# Altium project Archimajor.PrjPcb (part 3 of 3)

## Sheet Encoders.SchDoc
size Letter
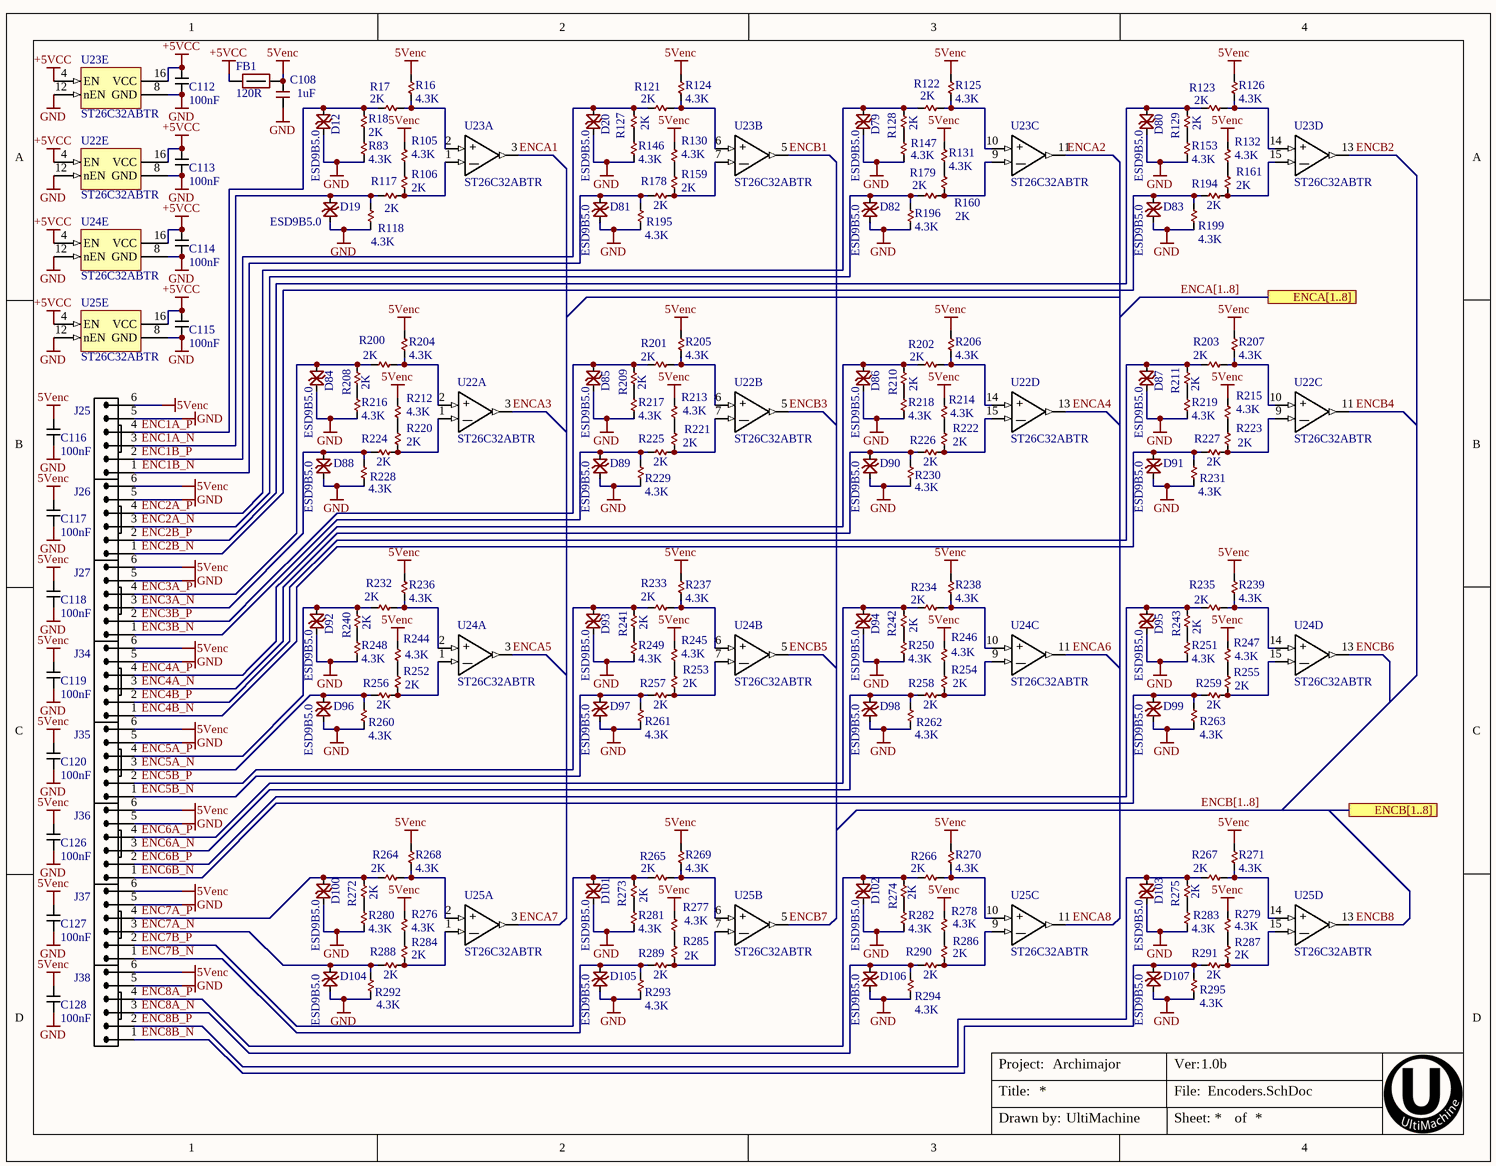
[diagram p7: Encoders.SchDoc]

### Parts
C108  1uF  [C0402]
C112  100nF  [C0201 Large Pads]
C113  100nF  [C0201 Large Pads]
C114  100nF  [C0201 Large Pads]
C115  100nF  [C0201 Large Pads]
C116  100nF  [C0201 Large Pads]
C117  100nF  [C0201 Large Pads]
C118  100nF  [C0201 Large Pads]
C119  100nF  [C0201 Large Pads]
C120  100nF  [C0201 Large Pads]
C126  100nF  [C0201 Large Pads]
C127  100nF  [C0201 Large Pads]
C128  100nF  [C0201 Large Pads]
D12  ESD9B5.0  [SOD923-D]
D19  ESD9B5.0  [SOD923-D]
D20  ESD9B5.0  [SOD923-D]
D79  ESD9B5.0  [SOD923-D]
D80  ESD9B5.0  [SOD923-D]
D81  ESD9B5.0  [SOD923-D]
D82  ESD9B5.0  [SOD923-D]
D83  ESD9B5.0  [SOD923-D]
D84  ESD9B5.0  [SOD923-D]
D85  ESD9B5.0  [SOD923-D]
D86  ESD9B5.0  [SOD923-D]
D87  ESD9B5.0  [SOD923-D]
D88  ESD9B5.0  [SOD923-D]
D89  ESD9B5.0  [SOD923-D]
D90  ESD9B5.0  [SOD923-D]
D91  ESD9B5.0  [SOD923-D]
D92  ESD9B5.0  [SOD923-D]
D93  ESD9B5.0  [SOD923-D]
D94  ESD9B5.0  [SOD923-D]
D95  ESD9B5.0  [SOD923-D]
D96  ESD9B5.0  [SOD923-D]
D97  ESD9B5.0  [SOD923-D]
D98  ESD9B5.0  [SOD923-D]
D99  ESD9B5.0  [SOD923-D]
D100  ESD9B5.0  [SOD923-D]
D101  ESD9B5.0  [SOD923-D]
D102  ESD9B5.0  [SOD923-D]
D103  ESD9B5.0  [SOD923-D]
D104  ESD9B5.0  [SOD923-D]
D105  ESD9B5.0  [SOD923-D]
D106  ESD9B5.0  [SOD923-D]
D107  ESD9B5.0  [SOD923-D]
FB1  120R  [FB0603]
J25  Molex 70543-05  [70543-05_PIN-IN-PASTE]  (value not drawn)
J26  Molex 70543-05  [70543-05_PIN-IN-PASTE]  (value not drawn)
J27  Molex 70543-05  [70543-05_PIN-IN-PASTE]  (value not drawn)
J34  Molex 70543-05  [70543-05_PIN-IN-PASTE]  (value not drawn)
J35  Molex 70543-05  [70543-05_PIN-IN-PASTE]  (value not drawn)
J36  Molex 70543-05  [70543-05_PIN-IN-PASTE]  (value not drawn)
J37  Molex 70543-05  [70543-05_PIN-IN-PASTE]  (value not drawn)
J38  Molex 70543-05  [70543-05_PIN-IN-PASTE]  (value not drawn)
R16  4.3K  [R0402]
R17  2K  [R0402]
R18  2K  [R0402]
R83  4.3K  [R0402]
R105  4.3K  [R0402]
R106  2K  [R0402]
R117  2K  [R0402]
R118  4.3K  [R0402]
R121  2K  [R0402]
R122  2K  [R0402]
R123  2K  [R0402]
R124  4.3K  [R0402]
R125  4.3K  [R0402]
R126  4.3K  [R0402]
R127  2K  [R0402]
R128  2K  [R0402]
R129  2K  [R0402]
R130  4.3K  [R0402]
R131  4.3K  [R0402]
R132  4.3K  [R0402]
R146  4.3K  [R0402]
R147  4.3K  [R0402]
R153  4.3K  [R0402]
R159  2K  [R0402]
R160  2K  [R0402]
R161  2K  [R0402]
R178  2K  [R0402]
R179  2K  [R0402]
R194  2K  [R0402]
R195  4.3K  [R0402]
R196  4.3K  [R0402]
R199  4.3K  [R0402]
R200  2K  [R0402]
R201  2K  [R0402]
R202  2K  [R0402]
R203  2K  [R0402]
R204  4.3K  [R0402]
R205  4.3K  [R0402]
R206  4.3K  [R0402]
R207  4.3K  [R0402]
R208  2K  [R0402]
R209  2K  [R0402]
R210  2K  [R0402]
R211  2K  [R0402]
R212  4.3K  [R0402]
R213  4.3K  [R0402]
R214  4.3K  [R0402]
R215  4.3K  [R0402]
R216  4.3K  [R0402]
R217  4.3K  [R0402]
R218  4.3K  [R0402]
R219  4.3K  [R0402]
R220  2K  [R0402]
R221  2K  [R0402]
R222  2K  [R0402]
R223  2K  [R0402]
R224  2K  [R0402]
R225  2K  [R0402]
R226  2K  [R0402]
R227  2K  [R0402]
R228  4.3K  [R0402]
R229  4.3K  [R0402]
R230  4.3K  [R0402]
R231  4.3K  [R0402]
R232  2K  [R0402]
R233  2K  [R0402]
R234  2K  [R0402]
R235  2K  [R0402]
R236  4.3K  [R0402]
R237  4.3K  [R0402]
R238  4.3K  [R0402]
R239  4.3K  [R0402]
R240  2K  [R0402]
R241  2K  [R0402]
R242  2K  [R0402]
R243  2K  [R0402]
R244  4.3K  [R0402]
R245  4.3K  [R0402]
R246  4.3K  [R0402]
R247  4.3K  [R0402]
R248  4.3K  [R0402]
R249  4.3K  [R0402]
R250  4.3K  [R0402]
R251  4.3K  [R0402]
R252  2K  [R0402]
R253  2K  [R0402]
R254  2K  [R0402]
R255  2K  [R0402]
R256  2K  [R0402]
R257  2K  [R0402]
R258  2K  [R0402]
R259  2K  [R0402]
R260  4.3K  [R0402]
R261  4.3K  [R0402]
R262  4.3K  [R0402]
R263  4.3K  [R0402]
R264  2K  [R0402]
R265  2K  [R0402]
R266  2K  [R0402]
R267  2K  [R0402]
R268  4.3K  [R0402]
R269  4.3K  [R0402]
R270  4.3K  [R0402]
R271  4.3K  [R0402]
R272  2K  [R0402]
R273  2K  [R0402]
R274  2K  [R0402]
R275  2K  [R0402]
R276  4.3K  [R0402]
R277  4.3K  [R0402]
R278  4.3K  [R0402]
R279  4.3K  [R0402]
R280  4.3K  [R0402]
R281  4.3K  [R0402]
R282  4.3K  [R0402]
R283  4.3K  [R0402]
R284  2K  [R0402]
R285  2K  [R0402]
R286  2K  [R0402]
R287  2K  [R0402]
R288  2K  [R0402]
R289  2K  [R0402]
R290  2K  [R0402]
R291  2K  [R0402]
R292  4.3K  [R0402]
R293  4.3K  [R0402]
R294  4.3K  [R0402]
R295  4.3K  [R0402]
U22  ST26C32ABTR  [TSSOP16-65P640X120-16N]  (parts A,B,C,D,E of 5)
U23  ST26C32ABTR  [TSSOP16-65P640X120-16N]  (parts A,B,C,D,E of 5)
U24  ST26C32ABTR  [TSSOP16-65P640X120-16N]  (parts A,B,C,D,E of 5)
U25  ST26C32ABTR  [TSSOP16-65P640X120-16N]  (parts A,B,C,D,E of 5)

### Ports
ENCA[1..8], ENCB[1..8]

### Nets
5Venc: C108.2 C116.2 C117.2 C118.2 C119.2 C120.2 C126.2 C127.2 C128.2 FB1.2 J25.6 J26.6 J27.6 J34.6 J35.6 J36.6 J37.6 J38.6 R16.2 R105.2 R124.2 R125.2 R126.2 R130.2 R131.2 R132.2 R204.2 R205.2 R206.2 R207.2 R212.2 R213.2 R214.2 R215.2 R236.2 R237.2 R238.2 R239.2 R244.2 R245.2 R246.2 R247.2 R268.2 R269.2 R270.2 R271.2 R276.2 R277.2 R278.2 R279.2
+5VCC: C112.2 C113.2 C114.2 C115.2 FB1.1 U22.4(EN) U22.16(VCC) U23.4(EN) U23.16(VCC) U24.4(EN) U24.16(VCC) U25.4(EN) U25.16(VCC)
GND: C108.1 C112.1 C113.1 C114.1 C115.1 C116.1 C117.1 C118.1 C119.1 C120.1 C126.1 C127.1 C128.1 D12.K D19.K D20.K D79.K D80.K D81.K D82.K D83.K D84.K D85.K D86.K D87.K D88.K D89.K D90.K D91.K D92.K D93.K D94.K D95.K D96.K D97.K D98.K D99.K D100.K D101.K D102.K D103.K D104.K D105.K D106.K D107.K J25.5 J26.5 J27.5 J34.5 J35.5 J36.5 J37.5 J38.5 R83.1 R118.1 R146.1 R147.1 R153.1 R195.1 R196.1 R199.1 R216.1 R217.1 R218.1 R219.1 R228.1 R229.1 R230.1 R231.1 R248.1 R249.1 R250.1 R251.1 R260.1 R261.1 R262.1 R263.1 R280.1 R281.1 R282.1 R283.1 R292.1 R293.1 R294.1 R295.1 U22.8(GND) U22.12(nEN) U23.8(GND) U23.12(nEN) U24.8(GND) U24.12(nEN) U25.8(GND) U25.12(nEN)
ENC1A_N: D19.A J25.3 R117.2 R118.2
ENC1A_P: D12.A J25.4 R17.1 R18.2
ENC1B_N: D81.A J25.1 R178.2 R195.2
ENC1B_P: D20.A J25.2 R121.1 R127.2
ENC2A_N: D82.A J26.3 R179.2 R196.2
ENC2A_P: D79.A J26.4 R122.1 R128.2
ENC2B_N: D83.A J26.1 R194.2 R199.2
ENC2B_P: D80.A J26.2 R123.1 R129.2
ENC3A_N: D88.A J27.3 R224.2 R228.2
ENC3A_P: D84.A J27.4 R200.1 R208.2
ENC3B_N: D89.A J27.1 R225.2 R229.2
ENC3B_P: D85.A J27.2 R201.1 R209.2
ENC4A_N: D90.A J34.3 R226.2 R230.2
ENC4A_P: D86.A J34.4 R202.1 R210.2
ENC4B_N: D91.A J34.1 R227.2 R231.2
ENC4B_P: D87.A J34.2 R203.1 R211.2
ENC5A_N: D96.A J35.3 R256.2 R260.2
ENC5A_P: D92.A J35.4 R232.1 R240.2
ENC5B_N: D97.A J35.1 R257.2 R261.2
ENC5B_P: D93.A J35.2 R233.1 R241.2
ENC6A_N: D98.A J36.3 R258.2 R262.2
ENC6A_P: D94.A J36.4 R234.1 R242.2
ENC6B_N: D99.A J36.1 R259.2 R263.2
ENC6B_P: D95.A J36.2 R235.1 R243.2
ENC7A_N: D104.A J37.3 R288.2 R292.2
ENC7A_P: D100.A J37.4 R264.1 R272.2
ENC7B_N: D105.A J37.1 R289.2 R293.2
ENC7B_P: D101.A J37.2 R265.1 R273.2
ENC8A_N: D106.A J38.3 R290.2 R294.2
ENC8A_P: D102.A J38.4 R266.1 R274.2
ENC8B_N: D107.A J38.1 R291.2 R295.2
ENC8B_P: D103.A J38.2 R267.1 R275.2
ENCA1: U23.3(OUT)
ENCA2: U23.11(OUT)
ENCA3: U22.3(OUT)
ENCA4: U22.13(OUT)
ENCA5: U24.3(OUT)
ENCA6: U24.11(OUT)
ENCA7: U25.3(OUT)
ENCA8: U25.11(OUT)
ENCB1: U23.5(OUT)
ENCB2: U23.13(OUT)
ENCB3: U22.5(OUT)
ENCB4: U22.11(OUT)
ENCB5: U24.5(OUT)
ENCB6: U24.13(OUT)
ENCB7: U25.5(OUT)
ENCB8: U25.13(OUT)
NetR16_1: R16.1 R17.2 U23.2(IN+)
NetR18_1: R18.1 R83.2
NetR105_1: R105.1 R106.2
NetR106_1: R106.1 R117.1 U23.1(IN-)
NetR121_2: R121.2 R124.1 U23.6(IN+)
NetR122_2: R122.2 R125.1 U23.10(IN+)
NetR123_2: R123.2 R126.1 U23.14(IN+)
NetR127_1: R127.1 R146.2
NetR128_1: R128.1 R147.2
NetR129_1: R129.1 R153.2
NetR130_1: R130.1 R159.2
NetR131_1: R131.1 R160.2
NetR132_1: R132.1 R161.2
NetR159_1: R159.1 R178.1 U23.7(IN-)
NetR160_1: R160.1 R179.1 U23.9(IN-)
NetR161_1: R161.1 R194.1 U23.15(IN-)
NetR200_2: R200.2 R204.1 U22.2(IN+)
NetR201_2: R201.2 R205.1 U22.6(IN+)
NetR202_2: R202.2 R206.1 U22.14(IN+)
NetR203_2: R203.2 R207.1 U22.10(IN+)
NetR208_1: R208.1 R216.2
NetR209_1: R209.1 R217.2
NetR210_1: R210.1 R218.2
NetR211_1: R211.1 R219.2
NetR212_1: R212.1 R220.2
NetR213_1: R213.1 R221.2
NetR214_1: R214.1 R222.2
NetR215_1: R215.1 R223.2
NetR220_1: R220.1 R224.1 U22.1(IN-)
NetR221_1: R221.1 R225.1 U22.7(IN-)
NetR222_1: R222.1 R226.1 U22.15(IN-)
NetR223_1: R223.1 R227.1 U22.9(IN-)
NetR232_2: R232.2 R236.1 U24.2(IN+)
NetR233_2: R233.2 R237.1 U24.6(IN+)
NetR234_2: R234.2 R238.1 U24.10(IN+)
NetR235_2: R235.2 R239.1 U24.14(IN+)
NetR240_1: R240.1 R248.2
NetR241_1: R241.1 R249.2
NetR242_1: R242.1 R250.2
NetR243_1: R243.1 R251.2
NetR244_1: R244.1 R252.2
NetR245_1: R245.1 R253.2
NetR246_1: R246.1 R254.2
NetR247_1: R247.1 R255.2
NetR252_1: R252.1 R256.1 U24.1(IN-)
NetR253_1: R253.1 R257.1 U24.7(IN-)
NetR254_1: R254.1 R258.1 U24.9(IN-)
NetR255_1: R255.1 R259.1 U24.15(IN-)
NetR264_2: R264.2 R268.1 U25.2(IN+)
NetR265_2: R265.2 R269.1 U25.6(IN+)
NetR266_2: R266.2 R270.1 U25.10(IN+)
NetR267_2: R267.2 R271.1 U25.14(IN+)
NetR272_1: R272.1 R280.2
NetR273_1: R273.1 R281.2
NetR274_1: R274.1 R282.2
NetR275_1: R275.1 R283.2
NetR276_1: R276.1 R284.2
NetR277_1: R277.1 R285.2
NetR278_1: R278.1 R286.2
NetR279_1: R279.1 R287.2
NetR284_1: R284.1 R288.1 U25.1(IN-)
NetR285_1: R285.1 R289.1 U25.7(IN-)
NetR286_1: R286.1 R290.1 U25.9(IN-)
NetR287_1: R287.1 R291.1 U25.15(IN-)

### Buses and harness runs
bus ENCA[1..8] = port ENCA[1..8]
bus ENCB[1..8] = port ENCB[1..8]

### Notes on the sheet
- Title:
- Project:
- File:
- Ver:
- Drawn by:
- Sheet:
- of
- (in symbol ST26C32ABTR, part A) +; _
- (in symbol ST26C32ABTR, part B) +; _
- (in symbol ST26C32ABTR, part C) +; _
- (in symbol ST26C32ABTR, part D) +; _

### Library data of the parts
C108 = 1uF 0402 6.3V X5R: CAP CER 0402 1uF 6.3V 10% X5R; MANUFACTURER: Murata; MANUFACTURER #: GRM155R60J105KE19D; PART: 1uF 6.3V X5R 0402; PART DESCRIPTION: 1µF ±10% 6.3V Ceramic Capacitor X5R 0402 (1005 Metric); DISTRIBUTOR #: 490-1320-2-ND; DISTRIBUTOR: Digikey; TOLERANCE: 10%; EE_SPEC: 6.3V; VALUE: 1uF
C112-C120 C126-C128 = 100nF 6.3V X5R 0201: CAP CER 0.1UF 6.3V 10% X5R 0201; MANUFACTURER: Samsung; MANUFACTURER #: CL03A104KQ3NNNC; VALUE: 100nF; DISTRIBUTOR: DIGI-KEY; DISTRIBUTOR #: 1276-1013-1-ND; TOLERANCE: 10%; VOLTAGE: 6.3V; PART: CL03A104KQ3NNNC
D12 D19 D20 D79-D107 = ESD9B5.0ST5G: TVS DIODE BIDIR 5VWM SOD923; MANUFACTURER: On Semi; TOLERANCE: -NA-; VALUE: 5V; EE_SPEC: 5Vso 15pF; MANUFACTURER #: ESD9B5.0ST5G; PART DESCRIPTION: TVS DIODE BIDIR 5VWM SOD923
FB1 = FERRITE 120R 3A 0603: FERRITE BEAD 120 OHM 0603 1LN; MANUFACTURER: Samsung; MANUFACTURER #: CIS10P121AC; MANUFACTURER2#: 490-5254-2-ND; VALUE: 120Rfb; TOLERANCE: -NA-; EE_SPEC: 3A; DISTRIBUTOR #: 1276-6351-2-ND; DISTRIBUTOR: Digi-Key Electronics; PART: CIS10P121AC; PART DESCRIPTION: FERRITE BEAD 120 OHM 0603 1LN
J25-J27 J34-J38 = CONN 6POS VERT 0.1" SHRD LOCKING PIP: 6 Positions Header, Shrouded Connector 0.100" (2.54mm) Through Hole Gold - Pin in Paste; MANUFACTURER #: 0705430005; PART: 6 Pin Conn VERT; TOLERANCE: -NA-; VALUE: HDR6; MANUFACTURER: Molex; PART DESCRIPTION: 6 Positions Header, Shrouded Connector 0.100" (2.54mm) Through Hole Gold; EE_SPEC: -NA-
R16 R83 R105 R118 R124-R126 R130-R132 R146 R147 R153 R195 R196 R199 R204-R207 R212-R219 R228-R231 R236-R239 R244-R251 R260-R263 R268-R271 R276-R283 R292-R295 = 4.3K 1% 0402: RES SMD 4.3K OHM 1% 1/16W 0402; MANUFACTURER: Yageo; MANUFACTURER #: RC0402FR-074K3L; PART DESCRIPTION: 2 kOhms ±1% 0.063W, 1/16W Chip Resistor 0402 (1005 Metric) Moisture Resistant Thick Film; PART: 4.3K 1% 0402; TOLERANCE: 1%; EE_SPEC: 1/16W; VALUE: 4.3K
R17 R18 R106 R117 R121-R123 R127-R129 R159-R161 R178 R179 R194 R200-R203 R208-R211 R220-R227 R232-R235 R240-R243 R252-R259 R264-R267 R272-R275 R284-R291 = 2K 1% 0402: RES SMD 2K OHM 1% 1/16W 0402; MANUFACTURER: Yageo; MANUFACTURER #: RC0402FR-072KL; PART DESCRIPTION: 2 kOhms ±1% 0.063W, 1/16W Chip Resistor 0402 (1005 Metric) Moisture Resistant Thick Film; PART: 2k 1% 0402; TOLERANCE: 1%; EE_SPEC: 1/16W; VALUE: 2K
U22-U25 = ST26C32ABTR: IC RECEIVER 0/4 16TSSOP; MANUFACTURER: STM; PART DESCRIPTION: 0/4 Receiver  RS422, RS423 16-TSSOP; Assembly Method: SMT; MANUFACTURER #: ST26C32ABTR; PART: ST26C32ABTR; VALUE: ST26C32ABTR

## Sheet FPGA.SchDoc
size Letter
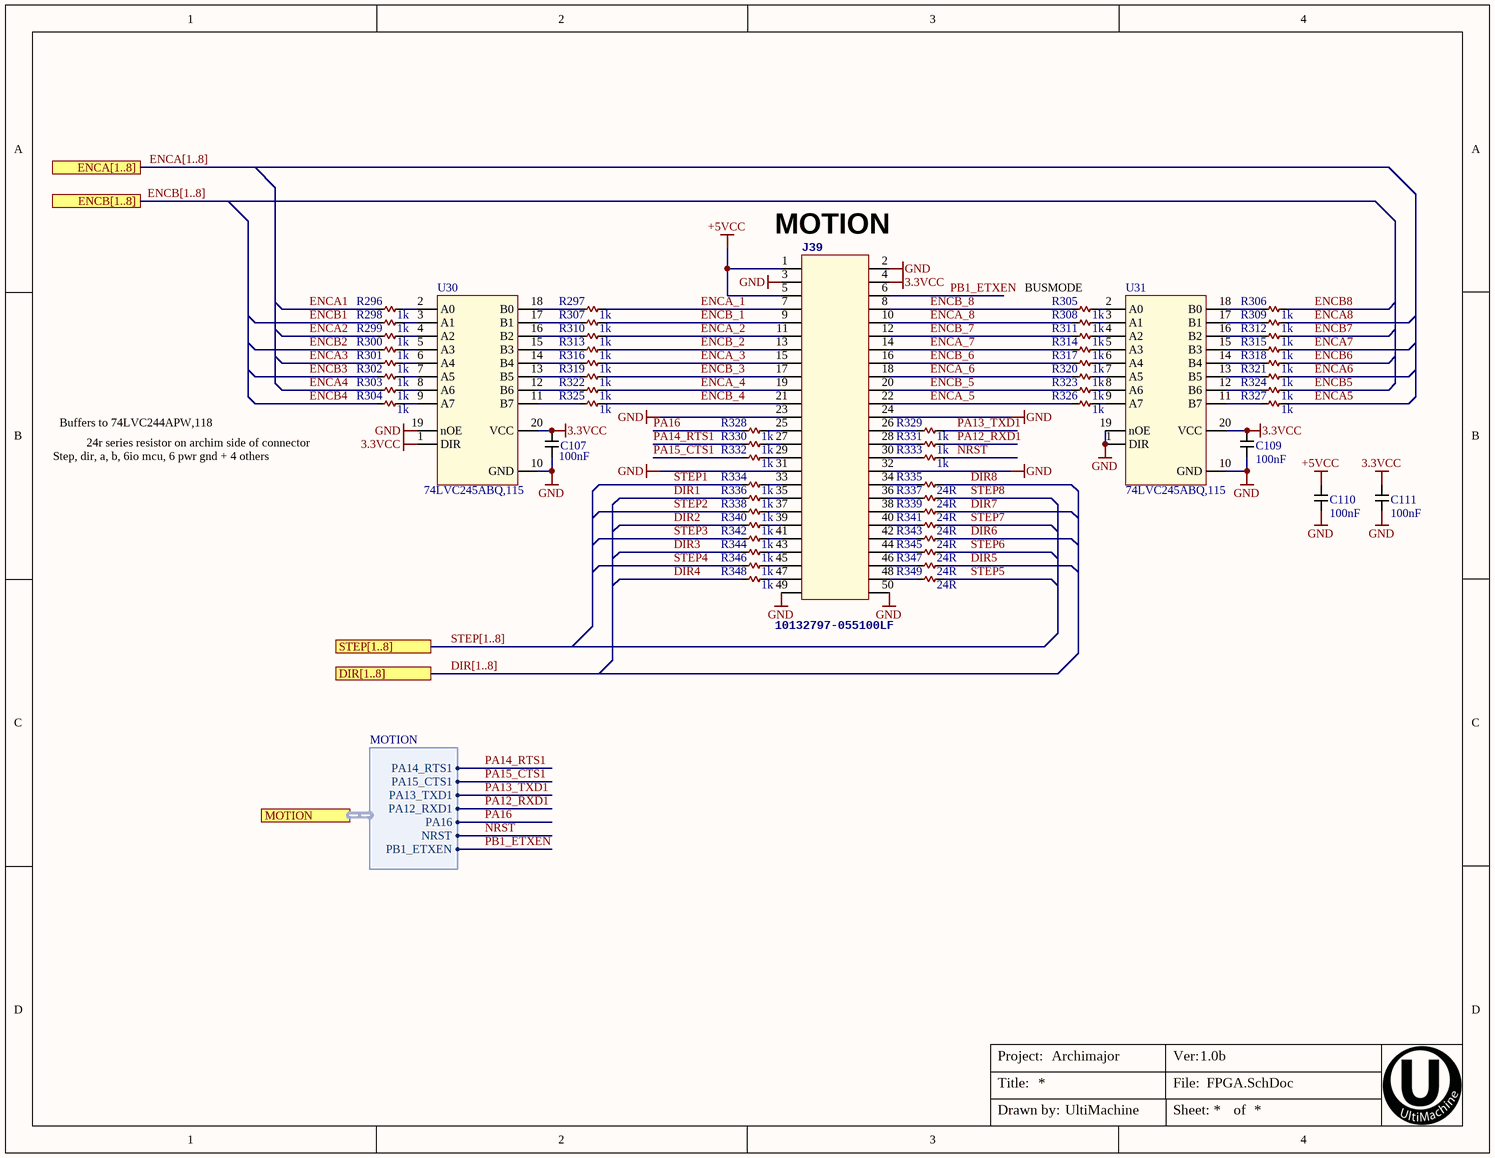
[diagram p8: FPGA.SchDoc]

### Parts
C107  100nF  [C0201 Large Pads]
C109  100nF  [C0201 Large Pads]
C110  100nF  [C0201 Large Pads]
C111  100nF  [C0201 Large Pads]
J39  10132797-055100LF  [BTB 0.5mm 50pin-Female]
R296  1k  [R0402]
R297  1k  [R0402]
R298  1k  [R0402]
R299  1k  [R0402]
R300  1k  [R0402]
R301  1k  [R0402]
R302  1k  [R0402]
R303  1k  [R0402]
R304  1k  [R0402]
R305  1k  [R0402]
R306  1k  [R0402]
R307  1k  [R0402]
R308  1k  [R0402]
R309  1k  [R0402]
R310  1k  [R0402]
R311  1k  [R0402]
R312  1k  [R0402]
R313  1k  [R0402]
R314  1k  [R0402]
R315  1k  [R0402]
R316  1k  [R0402]
R317  1k  [R0402]
R318  1k  [R0402]
R319  1k  [R0402]
R320  1k  [R0402]
R321  1k  [R0402]
R322  1k  [R0402]
R323  1k  [R0402]
R324  1k  [R0402]
R325  1k  [R0402]
R326  1k  [R0402]
R327  1k  [R0402]
R328  1k  [R0402]
R329  1k  [R0402]
R330  1k  [R0402]
R331  1k  [R0402]
R332  1k  [R0402]
R333  1k  [R0402]
R334  1k  [R0402]
R335  24R  [R0402]
R336  1k  [R0402]
R337  24R  [R0402]
R338  1k  [R0402]
R339  24R  [R0402]
R340  1k  [R0402]
R341  24R  [R0402]
R342  1k  [R0402]
R343  24R  [R0402]
R344  1k  [R0402]
R345  24R  [R0402]
R346  1k  [R0402]
R347  24R  [R0402]
R348  1k  [R0402]
R349  24R  [R0402]
U30  74LVC245ABQ,115  [QFN20-DHVQFN20-QFN50P250X450X100_HS-21L]
U31  74LVC245ABQ,115  [QFN20-DHVQFN20-QFN50P250X450X100_HS-21L]

### Ports
DIR[1..8], ENCA[1..8], ENCB[1..8], MOTION (harness MOTION), STEP[1..8]

### Harnesses
MOTION: PA14_RTS1, PA15_CTS1, PA13_TXD1, PA12_RXD1, PA16, NRST, PB1_ETXEN

### Nets
3.3VCC: C107.2 C109.2 C111.2 J39.4 U30.1(DIR) U30.20(VCC) U31.20(VCC)
+5VCC: C110.2 J39.1 J39.5
GND: C107.1 C109.1 C110.1 C111.1 J39.2 J39.3 J39.23 J39.24 J39.31 J39.32 J39.49 J39.50 U30.10(GND) U30.19(nOE) U31.1(DIR) U31.10(GND) U31.19(nOE)
DIR1: R336.1  [project net DIR]
DIR2: R340.1  [project net DIR]
DIR3: R344.1  [project net DIR]
DIR4: R348.1  [project net DIR]
DIR5: R347.2  [project net DIR]
DIR6: R343.2  [project net DIR]
DIR7: R339.2  [project net DIR]
DIR8: R335.2  [project net DIR]
ENCA1: R296.1
ENCA2: R299.1
ENCA3: R301.1
ENCA4: R303.1
ENCA5: R327.2
ENCA6: R321.2
ENCA7: R315.2
ENCA8: R309.2
ENCA_1: J39.7 R297.2
ENCA_2: J39.11 R310.2
ENCA_3: J39.15 R316.2
ENCA_4: J39.19 R322.2
ENCA_5: J39.22 R326.1
ENCA_6: J39.18 R320.1
ENCA_7: J39.14 R314.1
ENCA_8: J39.10 R308.1
ENCB1: R298.1
ENCB2: R300.1
ENCB3: R302.1
ENCB4: R304.1
ENCB5: R324.2
ENCB6: R318.2
ENCB7: R312.2
ENCB8: R306.2
ENCB_1: J39.9 R307.2
ENCB_2: J39.13 R313.2
ENCB_3: J39.17 R319.2
ENCB_4: J39.21 R325.2
ENCB_5: J39.20 R323.1
ENCB_6: J39.16 R317.1
ENCB_7: J39.12 R311.1
ENCB_8: J39.8 R305.1
NRST: R333.2 ; port MOTION.NRST
PA12_RXD1: R331.2 ; port MOTION.PA12_RXD1
PA13_TXD1: R329.2 ; port MOTION.PA13_TXD1
PA14_RTS1: R330.1 ; port MOTION.PA14_RTS1
PA15_CTS1: R332.1 ; port MOTION.PA15_CTS1
PA16: R328.1 ; port MOTION.PA16
PB1_ETXEN: J39.6 ; port MOTION.PB1_ETXEN
STEP1: R334.1  [project net STEP]
STEP2: R338.1  [project net STEP]
STEP3: R342.1  [project net STEP]
STEP4: R346.1  [project net STEP]
STEP5: R349.2  [project net STEP]
STEP6: R345.2  [project net STEP]
STEP7: R341.2  [project net STEP]
STEP8: R337.2  [project net STEP]
NetJ39_25: J39.25 R328.2
NetJ39_26: J39.26 R329.1
NetJ39_27: J39.27 R330.2
NetJ39_28: J39.28 R331.1
NetJ39_29: J39.29 R332.2
NetJ39_30: J39.30 R333.1
NetJ39_33: J39.33 R334.2
NetJ39_34: J39.34 R335.1
NetJ39_35: J39.35 R336.2
NetJ39_36: J39.36 R337.1
NetJ39_37: J39.37 R338.2
NetJ39_38: J39.38 R339.1
NetJ39_39: J39.39 R340.2
NetJ39_40: J39.40 R341.1
NetJ39_41: J39.41 R342.2
NetJ39_42: J39.42 R343.1
NetJ39_43: J39.43 R344.2
NetJ39_44: J39.44 R345.1
NetJ39_45: J39.45 R346.2
NetJ39_46: J39.46 R347.1
NetJ39_47: J39.47 R348.2
NetJ39_48: J39.48 R349.1
NetR296_2: R296.2 U30.2(A0)
NetR297_1: R297.1 U30.18(B0)
NetR298_2: R298.2 U30.3(A1)
NetR299_2: R299.2 U30.4(A2)
NetR300_2: R300.2 U30.5(A3)
NetR301_2: R301.2 U30.6(A4)
NetR302_2: R302.2 U30.7(A5)
NetR303_2: R303.2 U30.8(A6)
NetR304_2: R304.2 U30.9(A7)
NetR305_2: R305.2 U31.2(A0)
NetR306_1: R306.1 U31.18(B0)
NetR307_1: R307.1 U30.17(B1)
NetR308_2: R308.2 U31.3(A1)
NetR309_1: R309.1 U31.17(B1)
NetR310_1: R310.1 U30.16(B2)
NetR311_2: R311.2 U31.4(A2)
NetR312_1: R312.1 U31.16(B2)
NetR313_1: R313.1 U30.15(B3)
NetR314_2: R314.2 U31.5(A3)
NetR315_1: R315.1 U31.15(B3)
NetR316_1: R316.1 U30.14(B4)
NetR317_2: R317.2 U31.6(A4)
NetR318_1: R318.1 U31.14(B4)
NetR319_1: R319.1 U30.13(B5)
NetR320_2: R320.2 U31.7(A5)
NetR321_1: R321.1 U31.13(B5)
NetR322_1: R322.1 U30.12(B6)
NetR323_2: R323.2 U31.8(A6)
NetR324_1: R324.1 U31.12(B6)
NetR325_1: R325.1 U30.11(B7)
NetR326_2: R326.2 U31.9(A7)
NetR327_1: R327.1 U31.11(B7)

Not connected (* = marked no-connect by the designer): U30 23(NC); U31 23(NC)

### Buses and harness runs
bus DIR[1..8] = port DIR[1..8]
bus ENCA[1..8] = port ENCA[1..8]
bus ENCB[1..8] = port ENCB[1..8]
bus STEP[1..8] = port STEP[1..8]

### Notes on the sheet
- (near J39) MOTION
- BUSMODE
- Buffers to 74LVC244APW,118
- Step, dir, a, b, 6io mcu, 6 pwr gnd + 4 others
- 24r series resistor on archim side of connector
- Title:
- Project:
- File:
- Ver:
- Drawn by:
- Sheet:
- of

### Library data of the parts
C107 C109-C111 = 100nF 6.3V X5R 0201: CAP CER 0.1UF 6.3V 10% X5R 0201; PART: .1uF; MANUFACTURER: Samsung; MANUFACTURER #: CL03A104KQ3NNNC; DISTRIBUTOR: DIGI-KEY; DISTRIBUTOR #: 1276-1013-1-ND; TOLERANCE: 10%; VOLTAGE: 6.3V
J39 = CONN 50 PIN 0.5mm FEMALE: 50 Position Connector Plug, Outer Shroud Contacts Surface Mount Gold; EE_SPEC: 500V 1A 1.27mm; MANUFACTURER #: 10132797-055100LF; PART: 10132797-055100LF; Part Description: 50 Position Connector Plug, Outer Shroud Contacts Surface Mount Gold
R296-R334 R336 R338 R340 R342 R344 R346 R348 = 1k 1% 0402: RES 0402 1k 63mW 1%; MANUFACTURER: Yageo; MANUFACTURER #: RC0402FR-071KL; PART DESCRIPTION: 1k Ohm ±1% 0.063W, 1/16W Chip Resistor 0402 (1005 Metric) Moisture Resistant Thick Film; EE_SPEC: 1/16W; DISTRIBUTOR #: 311-1.00KLRTR-ND; DISTRIBUTOR: Digikey; PART: 1k 1% 0402; TOLERANCE: 1%; VALUE: 1k
R335 R337 R339 R341 R343 R345 R347 R349 = 24R 1% 0402: Res Thick Film 0402 24 Ohm 1% 0.063W; MANUFACTURER: Yageo; MANUFACTURER #: RC0402FR-0724RL; PART DESCRIPTION: 24 Ohm ±1% 0.063W, 1/16W Chip Resistor 0402 (1005 Metric) Moisture Resistant Thick Film; EE_SPEC: 1/16W; DISTRIBUTOR #: YAG3073TR-ND; DISTRIBUTOR: Digikey; PART: 24R 1% 0402; TOLERANCE: 1%; VALUE: 24R
U30 U31 = 74LVC245ABQ,115: IC TXRX NON-INVERT 3.6V 20DHVQFN; MANUFACTURER: Nexperia; PART DESCRIPTION: Transceiver, Non-Inverting 1 Element 8 Bit per Element 3-State Output 20-DHVQFN-EP (2.5x4.5); TOLERANCE: -NA-; EE_SPEC: 1.65-3.6Vcc, 5V tolerant inputs; MANUFACTURER #: 74LVC245ABQ,115; PART: 74LVC245ABQ,115; VALUE: 74LVC245ABQ,115

## Nets that join several sheets
3.3VCC: M1 (C149A.2 U15A.20), M2 (C149B.2 U15B.20), M3 (C149C.2 U15C.20), M4 (C149D.2 U15D.20), Power (C24.1 R33.2 TP47.1 U8.4), Microcontroller (40 pins), USB (7 pins), M5 (C149E.2 U15E.20), M6 (C149F.2 U15F.20), M7 (C149G.2 U15G.20), M8 (C149H.2 U15H.20), T1 (C60A.2 C62A.2 U13A.5 U13A.8), T2 (C60B.2 C62B.2 U13B.5 U13B.8), T3 (C60C.2 C62C.2 U13C.5 U13C.8), T4 (C60D.2 C62D.2 U13D.5 U13D.8), T5 (C60E.2 C62E.2 U13E.5 U13E.8), FPGA (7 pins)
+5VCC: Mosfets (10 pins), Power (8 pins), Microcontroller (8 pins), USB (JP1.1 R150.2 R151.2), Encoders (13 pins), FPGA (C110.2 J39.1 J39.5)
GND: M1 (26 pins), M2 (26 pins), M3 (26 pins), M4 (26 pins), Mosfets (34 pins), Power (67 pins), Microcontroller (98 pins), USB (23 pins), M5 (26 pins), M6 (26 pins), M7 (26 pins), M8 (26 pins), T1 (8 pins), T2 (8 pins), T3 (8 pins), T4 (8 pins), T5 (8 pins), Encoders (93 pins), FPGA (17 pins)
VBED: Mosfets (C11.1 D15.C R9.2), Power (8 pins)
VDDANA: Microcontroller (5 pins), USB (C76.1 C77.1 U11#2.75)
VMOT: M1 (11 pins), M2 (11 pins), M3 (11 pins), M4 (11 pins), Power (7 pins)
VMOT: Power (7 pins), M5 (11 pins), M6 (11 pins), M7 (11 pins), M8 (11 pins)
VPWR: Mosfets (12 pins), Power (21 pins)
DIAG1: M1 (R108A.2 U15A.27), Microcontroller (U11#1.63)
DIAG2: M2 (R108B.2 U15B.27), Microcontroller (U11#1.93)
DIAG3: M3 (R108C.2 U15C.27), Microcontroller (U11#1.97)
DIAG4: M4 (R108D.2 U15D.27), Microcontroller (U11#1.101)
DIAG5: Microcontroller (U11#1.131), M5 (R108E.2 U15E.27)
DIAG6: Microcontroller (U11#1.142), M6 (R108F.2 U15F.27)
DIAG7: Microcontroller (U11#1.3), M7 (R108G.2 U15G.27)
DIAG8: Microcontroller (U11#1.4), M8 (R108H.2 U15H.27)
DIR: M1 (U15A.18), Microcontroller (U11#1.64), FPGA (R336.1)
DIR: M2 (U15B.18), Microcontroller (U11#1.94), FPGA (R340.1)
DIR: M3 (U15C.18), Microcontroller (U11#1.98), FPGA (R344.1)
DIR: M4 (U15D.18), Microcontroller (U11#1.116), FPGA (R348.1)
DIR: Microcontroller (J23.2 U11#1.121), M7 (U15G.18), FPGA (R339.2)
DIR: Microcontroller (J23.3 U11#1.141), M5 (U15E.18), FPGA (R347.2)
DIR: Microcontroller (J23.7 U11#1.143), M6 (U15F.18), FPGA (R343.2)
DIR: Microcontroller (J23.6 U11#1.14), M8 (U15H.18), FPGA (R335.2)
DRV_EN: M1 (U15A.28), M2 (U15B.28), M3 (U15C.28), M4 (U15D.28), Microcontroller (U11#1.67), M5 (U15E.28), M6 (U15F.28), M7 (U15G.28), M8 (U15H.28)
ENCA1: Encoders (U23.3), FPGA (R296.1)
ENCA2: Encoders (U23.11), FPGA (R299.1)
ENCA3: Encoders (U22.3), FPGA (R301.1)
ENCA4: Encoders (U22.13), FPGA (R303.1)
ENCA5: Encoders (U24.3), FPGA (R327.2)
ENCA6: Encoders (U24.11), FPGA (R321.2)
ENCA7: Encoders (U25.3), FPGA (R315.2)
ENCA8: Encoders (U25.11), FPGA (R309.2)
ENCB1: Encoders (U23.5), FPGA (R298.1)
ENCB2: Encoders (U23.13), FPGA (R300.1)
ENCB3: Encoders (U22.5), FPGA (R302.1)
ENCB4: Encoders (U22.11), FPGA (R304.1)
ENCB5: Encoders (U24.5), FPGA (R324.2)
ENCB6: Encoders (U24.13), FPGA (R318.2)
ENCB7: Encoders (U25.5), FPGA (R312.2)
ENCB8: Encoders (U25.13), FPGA (R306.2)
Heat1: Mosfets (R54.2 U10.2), Microcontroller (U11#1.132)
Heat2: Mosfets (R39.2 U10.12), Microcontroller (U11#1.133)
Heat3: Mosfets (R29.2 U10.5), Microcontroller (U11#1.135)
HeatBed: Mosfets (R30.2 U10.9), Microcontroller (U11#1.134)
HTBD-OUT: Mosfets (6 pins), Power (J3.10)
M_nCS: M1 (U15A.13), Microcontroller (D70.K U11#1.83)
M_nCS: M2 (U15B.13), Microcontroller (D74.K U11#1.96)
M_nCS: M3 (U15C.13), Microcontroller (D75.K U11#1.100)
M_nCS: M4 (U15D.13), Microcontroller (D76.K U11#1.128)
M_nCS: Microcontroller (D40.K U11#1.119), M6 (U15F.13)
M_nCS: Microcontroller (D60.K U11#1.120), M5 (U15E.13)
M_nCS: Microcontroller (D41.K U11#1.13), M7 (U15G.13)
M_nCS: Microcontroller (D63.K U11#1.15), M8 (U15H.13)
MISO_M1BUS: M1 (R86A.1), M2 (R86B.1), M3 (R86C.1), M4 (R86D.1), Microcontroller (C75.1 U12.2 U16.5)
MISO_M2BUS: Microcontroller (C87.1 U16.9), M5 (R86E.1), M6 (R86F.1), M7 (R86G.1), M8 (R86H.1)
MISO_TCBUS: Microcontroller (C74.1 U16.2), T1 (R88A.2), T2 (R88B.2), T3 (R88C.2), T4 (R88D.2), T5 (R88E.2)
MOSI_M1BUS: M1 (U15A.15), M2 (U15B.15), M3 (U15C.15), M4 (U15D.15), Microcontroller (C88.1 R59.1 U12.5)
MOSI_M2BUS: Microcontroller (C89.1 R89.1), M5 (U15E.15), M6 (U15F.15), M7 (U15G.15), M8 (U15H.15)
MOSI_TCBUS: Microcontroller (C83.1 R84.1), T1 (U13A.12), T2 (U13B.12), T3 (U13C.12), T4 (U13D.12), T5 (U13E.12)
NRST: Microcontroller (D71.C J28.6 R145.2), USB (R149.1), FPGA (R333.2)
PA12_RXD1: Microcontroller (U11#1.5), FPGA (R331.2)
PA13_TXD1: Microcontroller (U11#1.6), FPGA (R329.2)
PA14_RTS1: Microcontroller (U11#1.7), FPGA (R330.1)
PA15_CTS1: Microcontroller (U11#1.8), FPGA (R332.1)
PA16: Microcontroller (U11#1.78), FPGA (R328.1)
PB1_ETXEN: Microcontroller (J20.6 U11#1.114), FPGA (J39.6)
RESET: Microcontroller (C40.1 J4.10 S1.1 TP56.1), USB (U11#2.47)
SCLK_M1BUS: M1 (U15A.14), M2 (U15B.14), M3 (U15C.14), M4 (U15D.14), Microcontroller (C104.2 R13.1 U12.6)
SCLK_M2BUS: Microcontroller (C85.2 R32.1), M5 (U15E.14), M6 (U15F.14), M7 (U15G.14), M8 (U15H.14)
SCLK_TCBUS: Microcontroller (C101.2 R3.1), T1 (U13A.10), T2 (U13B.10), T3 (U13C.10), T4 (U13D.10), T5 (U13E.10)
SD_MODE: M1 (U15A.21), M2 (U15B.21), M3 (U15C.21), M4 (U15D.21), M5 (U15E.21), M6 (U15F.21), M7 (U15G.21), M8 (U15H.21)
SPI_MODE: M1 (U15A.22), M2 (U15B.22), M3 (U15C.22), M4 (U15D.22), M5 (U15E.22), M6 (U15F.22), M7 (U15G.22), M8 (U15H.22)
STEP: M1 (U15A.17), Microcontroller (U11#1.65), FPGA (R334.1)
STEP: M2 (U15B.17), Microcontroller (U11#1.95), FPGA (R338.1)
STEP: M3 (U15C.17), Microcontroller (U11#1.99), FPGA (R342.1)
STEP: M4 (U15D.17), Microcontroller (U11#1.117), FPGA (R346.1)
STEP: Microcontroller (J23.5 U11#1.118), M5 (U15E.17), FPGA (R349.2)
STEP: Microcontroller (J23.4 U11#1.123), M7 (U15G.17), FPGA (R341.2)
STEP: Microcontroller (J23.9 U11#1.1), M6 (U15F.17), FPGA (R345.2)
STEP: Microcontroller (J23.8 U11#1.16), M8 (U15H.17), FPGA (R337.2)
TC_nCS1: Microcontroller (D61.K U11#1.138), T1 (TP11A.1 U13A.9)
TC_nCS2: Microcontroller (D30.K U11#1.127), T2 (TP11B.1 U13B.9)
TC_nCS3: Microcontroller (D31.K U11#1.82), T3 (TP11C.1 U13C.9)
TC_nCS4: Microcontroller (D5.K U11#1.85), T4 (TP11D.1 U13D.9)
TC_nCS5: Microcontroller (D62.K U11#1.88), T5 (TP11E.1 U13E.9)